# EAGLE schematic BinClock (EAGLE 9.6.0)
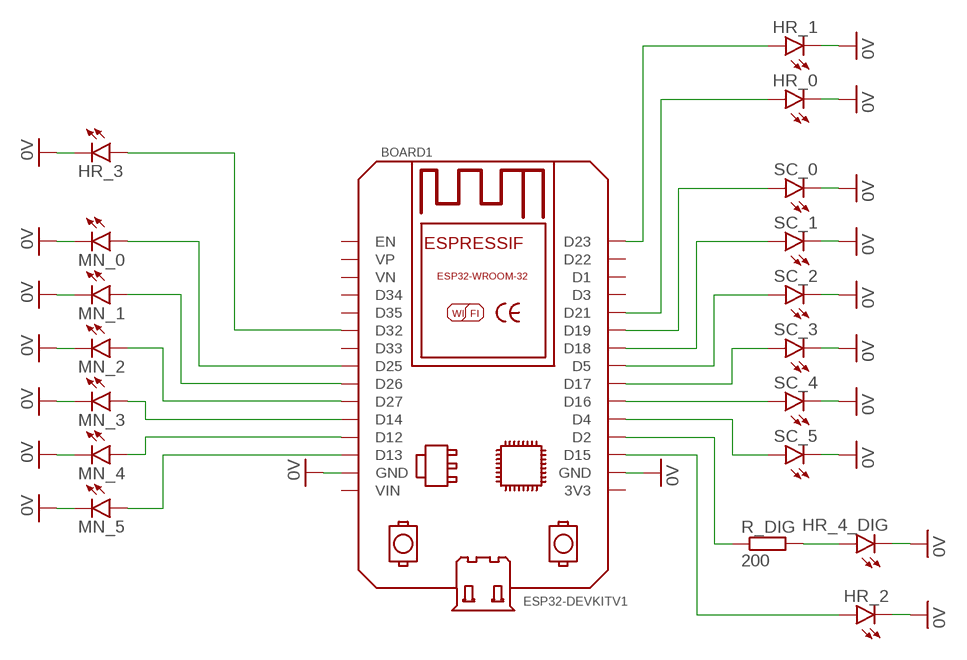
[diagram p0: schematic, sheet 1]

## Parts
BOARD1  ESP32DEVKITV1  [ESP32-DEVKITV1]
HR_0  LEDSQR2X5  [LED2X5]
HR_1  LEDSQR2X5  [LED2X5]
HR_2  LEDSQR2X5  [LED2X5]
HR_3  LEDSQR2X5  [LED2X5]
HR_4_DIG  LEDSQR2X5  [LED2X5]
MN_0  LEDSQR2X5  [LED2X5]
MN_1  LEDSQR2X5  [LED2X5]
MN_2  LEDSQR2X5  [LED2X5]
MN_3  LEDSQR2X5  [LED2X5]
MN_4  LEDSQR2X5  [LED2X5]
MN_5  LEDSQR2X5  [LED2X5]
R_DIG  200  R-EU_0204/7  [0204/7]
SC_0  LEDSQR2X5  [LED2X5]
SC_1  LEDSQR2X5  [LED2X5]
SC_2  LEDSQR2X5  [LED2X5]
SC_3  LEDSQR2X5  [LED2X5]
SC_4  LEDSQR2X5  [LED2X5]
SC_5  LEDSQR2X5  [LED2X5]

## Nets
0V: BOARD1.GND BOARD1.GND@1(GND) HR_0.K(C) HR_1.K(C) HR_2.K(C) HR_3.K(C) HR_4_DIG.K(C) MN_0.K(C) MN_1.K(C) MN_2.K(C) MN_3.K(C) MN_4.K(C) MN_5.K(C) SC_0.K(C) SC_1.K(C) SC_2.K(C) SC_3.K(C) SC_4.K(C) SC_5.K(C)
N$1: BOARD1.D4 SC_5.A
N$2: BOARD1.D16 SC_4.A
N$3: BOARD1.D17 SC_3.A
N$4: BOARD1.D5 SC_2.A
N$5: BOARD1.D18 SC_1.A
N$6: BOARD1.D19 SC_0.A
N$7: BOARD1.D2 R_DIG.1
N$8: BOARD1.D13 MN_5.A
N$9: BOARD1.D12 MN_4.A
N$10: BOARD1.D14 MN_3.A
N$11: BOARD1.D27 MN_2.A
N$12: BOARD1.D26 MN_1.A
N$13: BOARD1.D25 MN_0.A
N$14: HR_4_DIG.A R_DIG.2
N$15: BOARD1.D21 HR_0.A
N$16: BOARD1.D23 HR_1.A
N$18: BOARD1.D15 HR_2.A
N$19: BOARD1.D32 HR_3.A
Unconnected: BOARD1.3V3 BOARD1.D1 BOARD1.D3 BOARD1.D22 BOARD1.D33 BOARD1.D34 BOARD1.D35 BOARD1.EN BOARD1.VIN BOARD1.VN BOARD1.VP

## Library data of the parts
BOARD1 = ESP32-DEVKITV1:ESP32DEVKITV1: https://github.com/shridattdudhat
HR_0 HR_1-HR_3 HR_4_DIG MN_0 MN_1-MN_5 SC_0 SC_1-SC_5 = led:LED: LED OSRAM: - CHIPLED LG R971, LG N971, LY N971, LG Q971, LY Q971, LO R971, LY R971 LH N974, LH R974 LS Q976, LO Q976, LY Q976 LO Q996 - Hyper CHIPLED LW Q18S LB Q993, LB Q99A, LB R99A - SideLED LS A670, LO A670, LY A670, LG A670, LP A670 LB A673, LV A673, LT A673, LW A673 LH A674 LY A675 LS A676, LA A676, LO A676, LY A676, LW A676 LS A679, LY A679, LG A679 - Hyper Micro SIDELED® LS Y876, LA Y876, LO Y876, LY Y876 LT Y87S - SmartLED LW L88C, LW L88S LB L89C, LB L89S, LG L890 LS L89K, LO L89K, LY L89K LS L896, LA L896, LO L896, LY L896 - TOPLED LS T670, LO T670, LY T670, LG T670, LP T670 LSG T670, LSP T670, LSY T670, LOP T670, LYG T670 LG T671, LOG T671, LSG T671 LB T673, LV T673, LT T673, LW T673 LH T674 LS T676, LA T676, LO T676, LY T676, LB T676, LH T676, LSB T676, LW T676 LB T67C, LV T67C, LT T67C, LS T67K, LO T67K, LY T67K, LW E67C LS E67B, LA E67B, LO E67B, LY E67B, LB E67C, LV E67C, LT E67C LW T67C LS T679, LY T679, LG T679 LS T770, LO T770, LY T770, LG T770, LP T770 LB T773, LV T773, LT T773, LW T773 LH T774 LS E675, LA E675, LY E675, LS T675 LS T776, LA T776, LO T776, LY T776, LB T776 LHGB T686 LT T68C, LB T68C - Hyper Mini TOPLED® LB M676 - Mini TOPLED Santana® LG M470 LS M47K, LO M47K, LY M47K Source: http://www.osram.convergy.de LUXEON: - LUMILED® LXK2-PW12-R00, LXK2-PW12-S00, LXK2-PW14-U00, LXK2-PW14-V00 LXK2-PM12-R00, LXK2-PM12-S00, LXK2-PM14-U00 LXK2-PE12-Q00, LXK2-PE12-R00, LXK2-PE12-S00, LXK2-PE14-T00, LXK2-PE14-U00 LXK2-PB12-K00, LXK2-PB12-L00, LXK2-PB12-M00, LXK2-PB14-N00, LXK2-PB14-P00, LXK2-PB14-Q00 LXK2-PR12-L00, LXK2-PR12-M00, LXK2-PR14-Q00, LXK2-PR14-R00 LXK2-PD12-Q00, LXK2-PD12-R00, LXK2-PD12-S00 LXK2-PH12-R00, LXK2-PH12-S00 LXK2-PL12-P00, LXK2-PL12-Q00, LXK2-PL12-R00 Source: www.luxeon.com KINGBRIGHT: KA-3528ASYC Source: www.kingbright.com
R_DIG = rcl:R-EU_: RESISTOR, European symbol; SPICEPREFIX: R